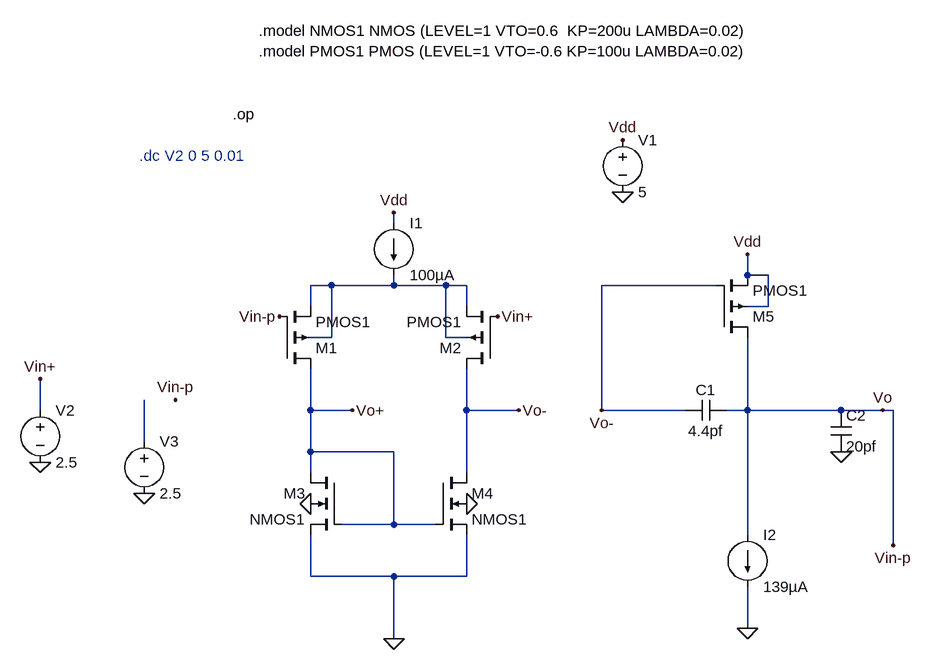
[diagram p0: schematic PMOS_diff_pair_PMOS_CS.asc]
PMOS_diff_pair_PMOS_CS.asc, the LTspice schematic file:
Version 4.1
SHEET 1 936 1212
WIRE -176 -144 -176 -160
WIRE 368 -64 368 -96
WIRE 400 -64 368 -64
WIRE -272 -48 -304 -48
WIRE -176 -48 -176 -64
WIRE -176 -48 -272 -48
WIRE -96 -48 -176 -48
WIRE -64 -48 -96 -48
WIRE 320 -48 144 -48
WIRE -304 -16 -304 -48
WIRE -64 -16 -64 -48
WIRE 400 -16 400 -64
WIRE 400 -16 368 -16
WIRE -272 32 -272 -48
WIRE -272 32 -304 32
WIRE -96 32 -96 -48
WIRE -64 32 -96 32
WIRE -720 144 -720 96
WIRE -304 144 -304 80
WIRE -240 144 -304 144
WIRE -64 144 -64 80
WIRE 16 144 -64 144
WIRE 144 144 144 -48
WIRE 272 144 144 144
WIRE 368 144 368 32
WIRE 368 144 336 144
WIRE 512 144 368 144
WIRE 576 144 512 144
WIRE 592 144 576 144
WIRE -560 192 -560 128
WIRE -304 208 -304 144
WIRE -176 208 -304 208
WIRE -304 240 -304 208
WIRE -64 240 -64 144
WIRE -176 320 -176 208
WIRE -176 320 -256 320
WIRE -112 320 -176 320
WIRE 368 336 368 144
WIRE 592 352 592 144
WIRE -304 400 -304 336
WIRE -176 400 -304 400
WIRE -64 400 -64 336
WIRE -64 400 -176 400
WIRE 368 480 368 416
WIRE -176 496 -176 400
FLAG -176 -160 Vdd
FLAG -176 496 0
FLAG -64 288 0
FLAG -304 288 0
FLAG -16 0 Vin+
FLAG -352 0 Vin-p
FLAG -720 224 0
FLAG -720 96 Vin+
FLAG 176 -192 0
FLAG 176 -272 Vdd
FLAG -240 144 Vo+
FLAG -560 272 0
FLAG 16 144 Vo-
FLAG -512 128 Vin-p
FLAG 368 -96 Vdd
FLAG 368 480 0
FLAG 576 144 Vo
FLAG 512 208 0
FLAG 144 144 Vo-
FLAG 592 352 Vin-p
DATAFLAG -304 160 ""
DATAFLAG -240 -48 ""
DATAFLAG -48 144 ""
DATAFLAG 416 144 ""
SYMBOL pmos4 -352 80 M180
SYMATTR InstName M1
SYMATTR Value PMOS1
SYMATTR Value2 l=300n w=3000n
SYMBOL pmos4 -16 80 R180
SYMATTR InstName M2
SYMATTR Value PMOS1
SYMATTR Value2 l=300n w=3000n
SYMBOL current -176 -144 R0
WINDOW 123 0 0 Left 0
WINDOW 39 0 0 Left 0
SYMATTR InstName I1
SYMATTR Value 100µA
SYMBOL nmos4 -256 240 M0
SYMATTR InstName M3
SYMATTR Value NMOS1
SYMATTR Value2 l=3000n w=150n
SYMBOL nmos4 -112 240 R0
SYMATTR InstName M4
SYMATTR Value NMOS1
SYMATTR Value2 l=3000n w=150n
SYMBOL voltage -720 128 R0
WINDOW 123 0 0 Left 0
WINDOW 39 0 0 Left 0
SYMATTR InstName V2
SYMATTR Value 2.5
SYMBOL voltage 176 -288 R0
WINDOW 123 0 0 Left 0
WINDOW 39 0 0 Left 0
SYMATTR InstName V1
SYMATTR Value 5
SYMBOL voltage -560 176 R0
WINDOW 123 0 0 Left 0
WINDOW 39 0 0 Left 0
SYMATTR InstName V3
SYMATTR Value 2.5
SYMBOL cap 336 128 R90
WINDOW 0 0 32 VBottom 2
WINDOW 3 32 32 VTop 2
SYMATTR InstName C1
SYMATTR Value 4.4pf
SYMBOL current 368 336 R0
WINDOW 123 0 0 Left 0
WINDOW 39 0 0 Left 0
SYMATTR InstName I2
SYMATTR Value 139µA
SYMBOL pmos4 320 32 M180
SYMATTR InstName M5
SYMATTR Value PMOS1
SYMATTR Value2 l=300n w=3300n
SYMBOL cap 496 144 R0
SYMATTR InstName C2
SYMATTR Value 20pf
TEXT -424 -312 Left 2 !.op
TEXT -384 -440 Left 2 !.model NMOS1 NMOS (LEVEL=1 VTO=0.6  KP=200u LAMBDA=0.02)\n.model PMOS1 PMOS (LEVEL=1 VTO=-0.6 KP=100u LAMBDA=0.02)
TEXT -568 -248 Left 2 ;.dc V2 0 5 0.01

The netlist it stands for:
* PMOS_diff_pair_PMOS_CS.asc
M1 Vo+ Vo N001 N001 PMOS1 l=300n w=3000n
M2 Vo- Vin+ N001 N001 PMOS1 l=300n w=3000n
I1 Vdd N001 100µA
M3 Vo+ Vo+ 0 0 NMOS1 l=3000n w=150n
M4 Vo- Vo+ 0 0 NMOS1 l=3000n w=150n
V2 Vin+ 0 2.5
V1 Vdd 0 5
V3 N002 0 2.5
C1 Vo Vo- 4.4pf
I2 Vo 0 139µA
M5 Vo Vo- Vdd Vdd PMOS1 l=300n w=3300n
C2 Vo 0 20pf
.model NMOS NMOS
.model PMOS PMOS
.lib standard.mos
.op
.model NMOS1 NMOS (LEVEL=1 VTO=0.6  KP=200u LAMBDA=0.02)
.model PMOS1 PMOS (LEVEL=1 VTO=-0.6 KP=100u LAMBDA=0.02)
* .dc V2 0 5 0.01
.backanno
.end